# Altium project Master.PrjPcb
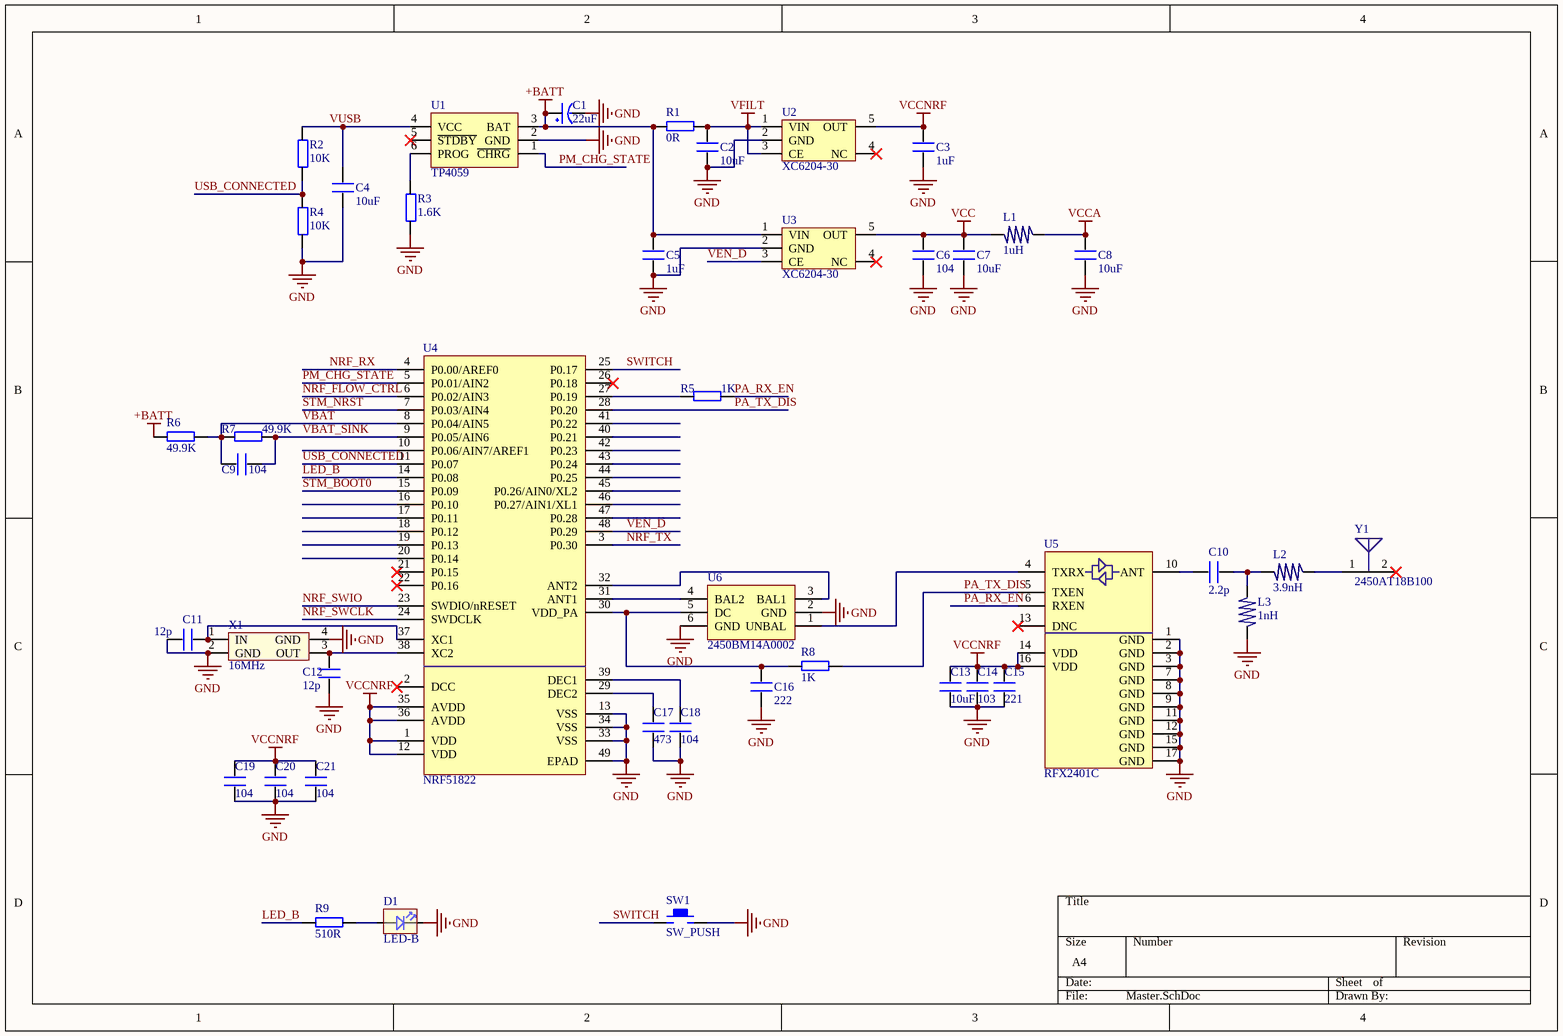
[diagram p0: Master.SchDoc]
3 sheets, 97 parts. Net scope: global (net labels, ports and power ports of the same name join across sheets).
Board file: Master_v2.1.PcbDoc
Sheets:
  Master.SchDoc
  Master_1.SchDoc
  Master_2.SchDoc

## Sheet Master.SchDoc
size A4; PageSetup: Record=PageOptions|CenterHorizontal=True|CenterVertical=True|PrintScale=1.00|XCorrection=1.00|YCorrection=1.00|PrintKind=0|BorderSize=5000000|LeftOffset=0|BottomOffset=0|Orientation=2|PaperLength=1000|PaperWidth=1000|Scale=100|PaperSource=7|PrintQuality=-4|MediaType=1|DitherType=10|PaperKind=A4|PrintScaleMode=1

### Parts
C1  22uF  [C0805 钽电容]
C2  10uF  [0603P]
C3  1uF  [0402]
C4  10uF  [0603P]
C5  1uF  [0402]
C6  104  [0402]
C7  10uF  [0603P]
C8  10uF  [0603P]
C9  104  [0402]
C10  2.2p  [0402]
C11  12p  [0402]
C12  12p  [0402]
C13  10uF  [0603P]
C14  103  [0402]
C15  221  [0402]
C16  222  [0402]
C17  473  [0402]
C18  104  [0402]
C19  104  [0402]
C20  104  [0402]
C21  104  [0402]
D1  LED-B  [LED1206  侧贴]
L1  1uH  [0603P]
L2  3.9nH  [0603P]
L3  1nH  [0603P]
R1  0R  [0402]
R2  10K  [0402]
R3  1.6K  [0402]
R4  10K  [0402]
R5  1K  [0402]
R6  49.9K  [0402]
R7  49.9K  [0402]
R8  1K  [0402]
R9  510R  [0402]
SW1  SW_PUSH  [KEY_2S]
U1  TP4059  [SOT23-6S]
U2  XC6204-30  [SOT23-5S]
U3  XC6204-30  [SOT23-5S]
U4  NRF51822  [QFN48M-04]
U5  RFX2401C  [QFN16M]
U6  2450BM14A0002  [0603-6]
X1  16MHz  [XTAL3225   无源]
Y1  2450AT18B100  [1206]

### Nets
+BATT: C1.1(VCC) C5.2 R1.2 R6.2 U1.3(BAT) U3.1(VIN)
GND: C1.2(GND) C2.1 C3.1 C4.1 C5.1 C6.1 C7.1 C8.1 C11.2 C12.2 C13.2 C14.2 C15.2 C16.2 C17.2 C18.2 C19.2 C20.2 C21.2 D1.1 L3.2 R3.1 R4.1 SW1.2 U1.2(GND) U2.2(GND) U3.2(GND) U4.13(VSS) U4.33(VSS) U4.34(VSS) U4.49(EPAD) U5.1(GND) U5.2(GND) U5.3(GND) U5.7(GND) U5.8(GND) U5.9(GND) U5.11(GND) U5.12(GND) U5.15(GND) U5.17(GND) U6.2(GND) U6.6(GND) X1.2(GND) X1.4(GND)
VCC: C6.2 C7.2 L1.2 U3.5(OUT)
VCCA: C8.2 L1.1
VCCNRF: C3.2 C13.1 C14.1 C15.1 C19.1 C20.1 C21.1 U2.5(OUT) U4.1(VDD) U4.12(VDD) U4.35(AVDD) U4.36(AVDD) U5.14(VDD) U5.16(VDD)
VFILT: C2.2 R1.1 U2.1(VIN) U2.3(CE)
LED_B: R9.2 U4.14(P0.08)
NRF_FLOW_CTRL: U4.6(P0.02/AIN3)
NRF_RX: U4.4(P0.00/AREF0)
NRF_SWCLK: U4.24(SWDCLK)
NRF_SWIO: U4.23(SWDIO/nRESET)
NRF_TX: U4.3(P0.30)
PA_RX_EN: R5.1 U5.6(RXEN)
PA_TX_DIS: R8.1 U4.28(P0.20) U5.5(TXEN)
PM_CHG_STATE: U1.1(~{CHRG}) U4.5(P0.01/AIN2)
STM_BOOT0: U4.15(P0.09)
STM_NRST: U4.7(P0.03/AIN4)
SWITCH: SW1.1 U4.25(P0.17)
USB_CONNECTED: R2.1 R4.2 U4.11(P0.07)
VBAT: C9.2 R6.1 R7.2 U4.8(P0.04/AIN5)
VBAT_SINK: C9.1 R7.1 U4.9(P0.05/AIN6)
VEN_D: U3.3(CE) U4.48(P0.29)
VUSB: C4.2 R2.2 U1.4(VCC)
NetC10_1: C10.1 U5.10(ANT)
NetC10_2: C10.2 L2.2 L3.1
NetC11_1: C11.1 U4.37(XC1) X1.1(IN)
NetC12_1: C12.1 U4.38(XC2) X1.3(OUT)
NetC16_1: C16.1 R8.2 U4.30(VDD_PA) U6.5(DC)
NetC17_1: C17.1 U4.29(DEC2)
NetC18_1: C18.1 U4.39(DEC1)
NetD1_3: D1.3 R9.1
NetL2_1: L2.1 Y1.1(FP)
NetR3_2: R3.2 U1.6(PROG)
NetR5_2: R5.2 U4.27(P0.19)
NetU4_31: U4.31(ANT1) U6.4(BAL2)
NetU4_32: U4.32(ANT2) U6.3(BAL1)
NetU5_4: U5.4(TXRX) U6.1(UNBAL)

Not connected (* = marked no-connect by the designer): D1 2; U1 5(~{STDBY})*; U2 4(NC)*; U3 4(NC)*; U4 2(DCC)* 10(P0.06/AIN7/AREF1) 16(P0.10) 17(P0.11) 18(P0.12) 19(P0.13) 20(P0.14) 21(P0.15)* 22(P0.16)* 26(P0.18)* 40(P0.21) 41(P0.22) 42(P0.23) 43(P0.24) 44(P0.25) 45(P0.26/AIN0/XL2) 46(P0.27/AIN1/XL1) 47(P0.28); U5 13(DNC)*; Y1 2(NC)*

### Library data of the parts
C1 = CAP
C2-C21 = C
D1 = LED 1206 侧贴  单色
L1-L3 = L
R1-R9 = R
SW1 = KEY
U2 U3 = XC6204
U6 = BALUN
X1 = XTAL-无源贴片: 无源贴片晶振
Y1 = CHIP_ANTENNA

## Sheet Master_1.SchDoc
size A4
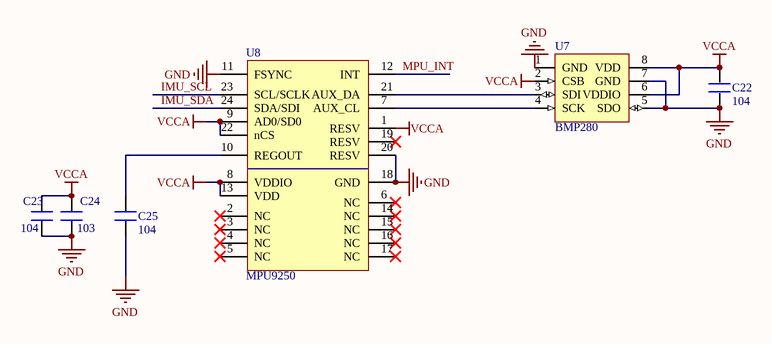
[diagram p1: Master_1.SchDoc]

### Parts
C22  104  [0402]
C23  104  [0402]
C24  103  [0402]
C25  104  [0402]
U7  BMP280  [LGA-8]
U8  MPU9250  [QFN24-0.4]

### Nets
GND: C22.1 C23.1 C24.1 C25.1 U7.1(GND) U7.5(SDO) U7.7(GND) U8.11(FSYNC) U8.18(GND) U8.20(RESV)
VCCA: C22.2 C23.2 C24.2 U7.2(CSB) U7.6(VDDIO) U7.8(VDD) U8.1(RESV) U8.8(VDDIO) U8.9(AD0/SD0) U8.13(VDD) U8.22(nCS)
IMU_SCL: U8.23(SCL/SCLK)
IMU_SDA: U8.24(SDA/SDI)
MPU_INT: U8.12(INT)
NetC25_2: C25.2 U8.10(REGOUT)
NetU7_3: U7.3(SDI) U8.21(AUX_DA)
NetU7_4: U7.4(SCK) U8.7(AUX_CL)

Not connected (* = marked no-connect by the designer): U8 2(NC)* 3(NC)* 4(NC)* 5(NC)* 6(NC)* 14(NC)* 15(NC)* 16(NC)* 17(NC)* 19(RESV)*

### Library data of the parts
C22-C25 = C

## Sheet Master_2.SchDoc
size A4
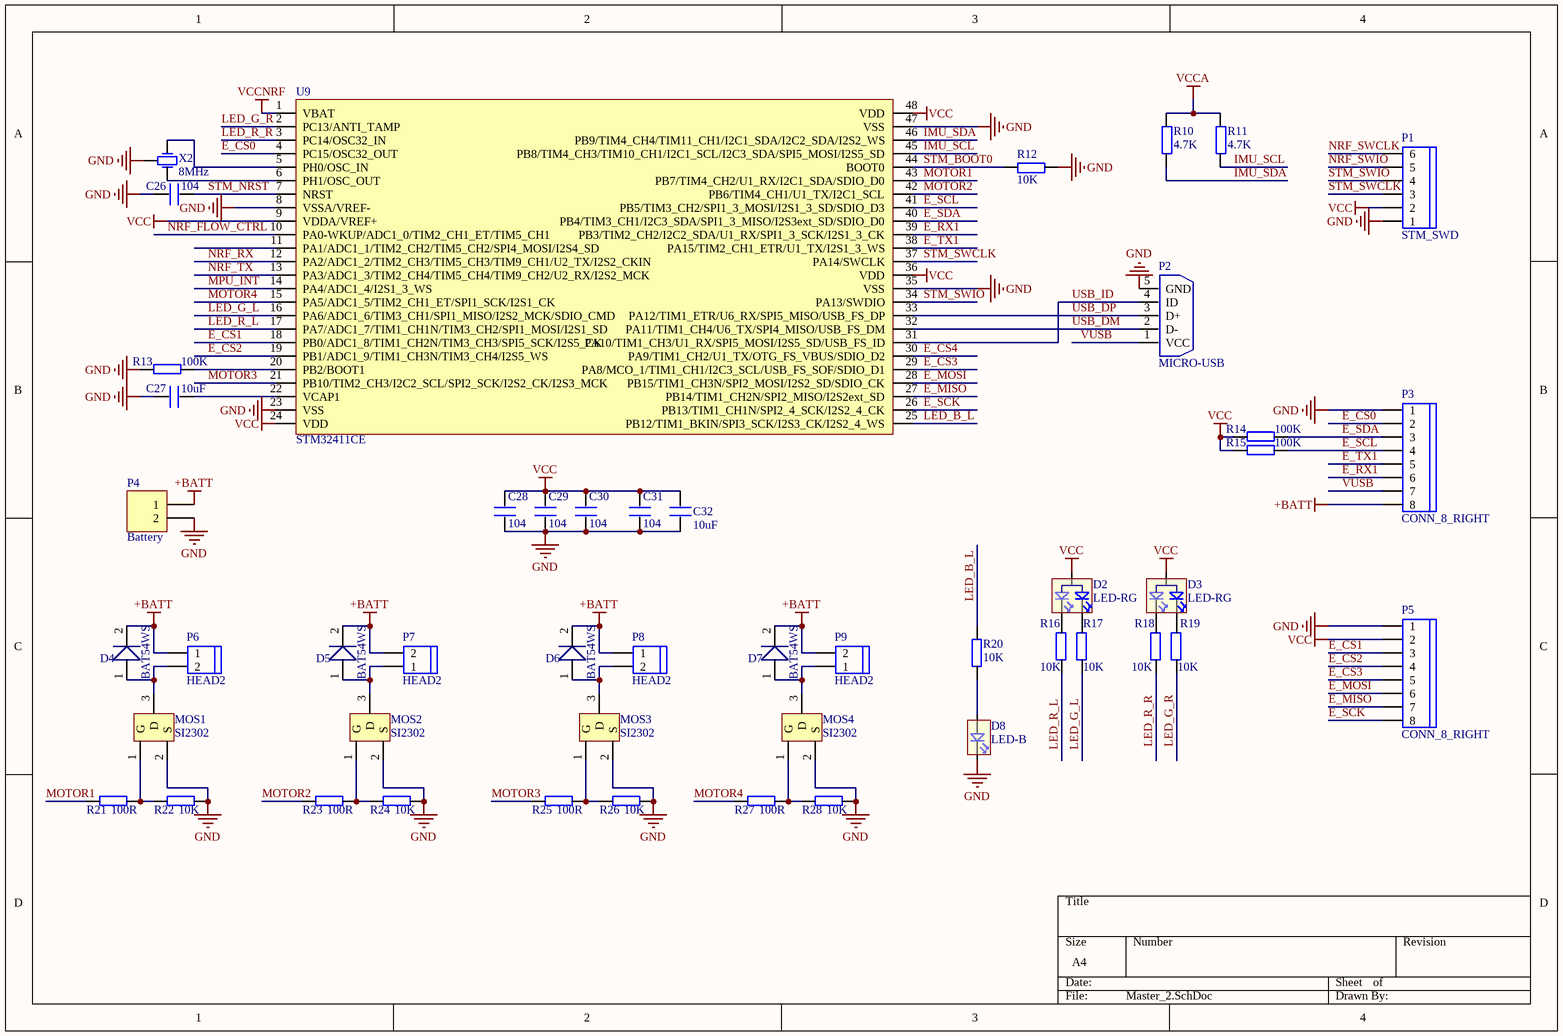
[diagram p2: Master_2.SchDoc]

### Parts
C26  104  [0402]
C27  10uF  [0603P]
C28  104  [0402]
C29  104  [0402]
C30  104  [0402]
C31  104  [0402]
C32  10uF  [0603P]
D2  LED-RG  [LED1206  侧贴]
D3  LED-RG  [LED1206  侧贴]
D4  BAT54WS  [SOD-323]
D5  BAT54WS  [SOD-323]
D6  BAT54WS  [SOD-323]
D7  BAT54WS  [SOD-323]
D8  LED-B  [LED1206  侧贴]
MOS1  SI2302  [SO-G3/C2.5]
MOS2  SI2302  [SO-G3/C2.5]
MOS3  SI2302  [SO-G3/C2.5]
MOS4  SI2302  [SO-G3/C2.5]
P1  STM_SWD  [SH1.0-6P]
P2  MICRO-USB  [MICRO_USB5P_SOP]
P3  CONN_8_RIGHT  [HEADER8-2.0MM-SMD]
P4  Battery  [HDR1X2]
P5  CONN_8_RIGHT  [HEADER8-2.0MM-SMD]
P6  HEAD2  [HEADER2-1.25MM]
P7  HEAD2  [HEADER2-1.25MM]
P8  HEAD2  [HEADER2-1.25MM]
P9  HEAD2  [HEADER2-1.25MM]
R10  4.7K  [0402]
R11  4.7K  [0402]
R12  10K  [0402]
R13  100K  [0402]
R14  100K  [0402]
R15  100K  [0402]
R16  10K  [0402]
R17  10K  [0402]
R18  10K  [0402]
R19  10K  [0402]
R20  10K  [0402]
R21  100R  [0402]
R22  10K  [0402]
R23  100R  [0402]
R24  10K  [0402]
R25  100R  [0402]
R26  10K  [0402]
R27  100R  [0402]
R28  10K  [0402]
U9  STM32411CE  [UFQFPN48]
X2  8MHz  [XTAL3215]

### Nets
+BATT: D4.2 D5.2 D6.2 D7.2 P3.8 P4.1 P6.1 P7.2 P8.1 P9.2
GND: C26.1 C27.1 C28.1 C29.1 C30.1 C31.1 C32.1 D8.1 MOS1.2(S) MOS2.2(S) MOS3.2(S) MOS4.2(S) P1.1 P2.5(GND) P3.1 P4.2 P5.1 R12.2 R13.2 R22.1 R24.1 R26.1 R28.1 U9.8(VSSA/VREF-) U9.23(VSS) U9.35(VSS) U9.47(VSS) X2.2(GND)
VCC: C28.2 C29.2 C30.2 C31.2 C32.2 D2.3 D3.3 P1.2 P5.2 R14.2 R15.2 U9.9(VDDA/VREF+) U9.24(VDD) U9.36(VDD) U9.48(VDD)
VCCA: R10.2 R11.2
VCCNRF: U9.1(VBAT)
E_CS0: P3.2 U9.4(PC15/OSC32_OUT)
E_CS1: P5.3 U9.18(PB0/ADC1_8/TIM1_CH2N/TIM3_CH3/SPI5_SCK/I2S5_CK)
E_CS2: P5.4 U9.19(PB1/ADC1_9/TIM1_CH3N/TIM3_CH4/I2S5_WS)
E_CS3: P5.5 U9.29(PA8/MCO_1/TIM1_CH1/I2C3_SCL/USB_FS_SOF/SDIO_D1)
E_CS4: U9.30(PA9/TIM1_CH2/U1_TX/OTG_FS_VBUS/SDIO_D2)
E_MISO: P5.7 U9.27(PB14/TIM1_CH2N/SPI2_MISO/I2S2ext_SD)
E_MOSI: P5.6 U9.28(PB15/TIM1_CH3N/SPI2_MOSI/I2S2_SD/SDIO_CK)
E_RX1: P3.6 U9.39(PB3/TIM2_CH2/I2C2_SDA/U1_RX/SPI1_3_SCK/I2S1_3_CK)
E_SCK: P5.8 U9.26(PB13/TIM1_CH1N/SPI2_4_SCK/I2S2_4_CK)
E_SCL: P3.4 R15.1 U9.41(PB5/TIM3_CH2/SPI1_3_MOSI/I2S1_3_SD/SDIO_D3)
E_SDA: P3.3 R14.1 U9.40(PB4/TIM3_CH1/I2C3_SDA/SPI1_3_MISO/I2S3ext_SD/SDIO_D0)
E_TX1: P3.5 U9.38(PA15/TIM2_CH1_ETR/U1_TX/I2S1_3_WS)
IMU_SCL: R11.1 U9.45(PB8/TIM4_CH3/TIM10_CH1/I2C1_SCL/I2C3_SDA/SPI5_MOSI/I2S5_SD)
IMU_SDA: R10.1 U9.46(PB9/TIM4_CH4/TIM11_CH1/I2C1_SDA/I2C2_SDA/I2S2_WS)
LED_B_L: R20.1 U9.25(PB12/TIM1_BKIN/SPI3_SCK/I2S3_CK/I2S2_4_WS)
LED_G_L: R17.2 U9.16(PA6/ADC1_6/TIM3_CH1/SPI1_MISO/I2S2_MCK/SDIO_CMD)
LED_G_R: R19.2 U9.2(PC13/ANTI_TAMP)
LED_R_L: R16.2 U9.17(PA7/ADC1_7/TIM1_CH1N/TIM3_CH2/SPI1_MOSI/I2S1_SD)
LED_R_R: R18.2 U9.3(PC14/OSC32_IN)
MOTOR1: R21.2 U9.43(PB7/TIM4_CH2/U1_RX/I2C1_SDA/SDIO_D0)
MOTOR2: R23.2 U9.42(PB6/TIM4_CH1/U1_TX/I2C1_SCL)
MOTOR3: R25.2 U9.21(PB10/TIM2_CH3/I2C2_SCL/SPI2_SCK/I2S2_CK/I2S3_MCK)
MOTOR4: R27.2 U9.15(PA5/ADC1_5/TIM2_CH1_ET/SPI1_SCK/I2S1_CK)
MPU_INT: U9.14(PA4/ADC1_4/I2S1_3_WS)
NRF_FLOW_CTRL: U9.10(PA0-WKUP/ADC1_0/TIM2_CH1_ET/TIM5_CH1)
NRF_RX: U9.12(PA2/ADC1_2/TIM2_CH3/TIM5_CH3/TIM9_CH1/U2_TX/I2S2_CKIN)
NRF_SWCLK: P1.6
NRF_SWIO: P1.5
NRF_TX: U9.13(PA3/ADC1_3/TIM2_CH4/TIM5_CH4/TIM9_CH2/U2_RX/I2S2_MCK)
STM_BOOT0: R12.1 U9.44(BOOT0)
STM_NRST: C26.2 U9.7(NRST)
STM_SWCLK: P1.3 U9.37(PA14/SWCLK)
STM_SWIO: P1.4 U9.34(PA13/SWDIO)
USB_DM: P2.2(D-) U9.32(PA11/TIM1_CH4/U6_TX/SPI4_MISO/USB_FS_DM)
USB_DP: P2.3(D+) U9.33(PA12/TIM1_ETR/U6_RX/SPI5_MISO/USB_FS_DP)
USB_ID: P2.4(ID) U9.31(PA10/TIM1_CH3/U1_RX/SPI5_MOSI/I2S5_SD/USB_FS_ID)
VUSB: P2.1(VCC) P3.7
NetC27_2: C27.2 U9.22(VCAP1)
NetD2_1: D2.1 R16.1
NetD2_2: D2.2 R17.1
NetD3_1: D3.1 R18.1
NetD3_2: D3.2 R19.1
NetD4_1: D4.1 MOS1.3(D) P6.2
NetD5_1: D5.1 MOS2.3(D) P7.1
NetD6_1: D6.1 MOS3.3(D) P8.2
NetD7_1: D7.1 MOS4.3(D) P9.1
NetD8_3: D8.3 R20.2
NetMOS1_1: MOS1.1(G) R21.1 R22.2
NetMOS2_1: MOS2.1(G) R23.1 R24.2
NetMOS3_1: MOS3.1(G) R25.1 R26.2
NetMOS4_1: MOS4.1(G) R27.1 R28.2
NetR13_1: R13.1 U9.20(PB2/BOOT1)
NetU9_5: U9.5(PH0/OSC_IN) X2.1(OSC1)
NetU9_6: U9.6(PH1/OSC_OUT) X2.3(OSC2)

Not connected (* = marked no-connect by the designer): D8 2; U9 11(PA1/ADC1_1/TIM2_CH2/TIM5_CH2/SPI4_MOSI/I2S4_SD)

### Library data of the parts
C26-C32 = C
D2 D3 = LED 1206 侧贴 双色
D4-D7 = BAT54: 单肖特基二极管
D8 = LED 1206 侧贴  单色
MOS1-MOS4 = MOS-N: AP2306
P1 = HEAD6
P2 = USB5
P3 P5 = HEAD8
P4 = Header 2: Header, 2-Pin; LatestRevisionDate: 17-Jul-2002; LatestRevisionNote: Re-released for DXP Platform.; Publisher: Altium Limited
R10-R28 = R
U9 = STM32F411xC_xE: STM32411xC_xE
X2 = XTAL-3215

## Nets that join several sheets
+BATT: Master (6 pins), Master_2 (10 pins)
GND: Master (45 pins), Master_1 (10 pins), Master_2 (28 pins)
VCC: Master (C6.2 C7.2 L1.2 U3.5), Master_2 (15 pins)
VCCA: Master (C8.2 L1.1), Master_1 (11 pins), Master_2 (R10.2 R11.2)
VCCNRF: Master (14 pins), Master_2 (U9.1)
IMU_SCL: Master_1 (U8.23), Master_2 (R11.1 U9.45)
IMU_SDA: Master_1 (U8.24), Master_2 (R10.1 U9.46)
MPU_INT: Master_1 (U8.12), Master_2 (U9.14)
NRF_FLOW_CTRL: Master (U4.6), Master_2 (U9.10)
NRF_RX: Master (U4.4), Master_2 (U9.12)
NRF_SWCLK: Master (U4.24), Master_2 (P1.6)
NRF_SWIO: Master (U4.23), Master_2 (P1.5)
NRF_TX: Master (U4.3), Master_2 (U9.13)
STM_BOOT0: Master (U4.15), Master_2 (R12.1 U9.44)
STM_NRST: Master (U4.7), Master_2 (C26.2 U9.7)
VUSB: Master (C4.2 R2.2 U1.4), Master_2 (P2.1 P3.7)